# EAGLE schematic VoltCalBoard (EAGLE 6.5.0)
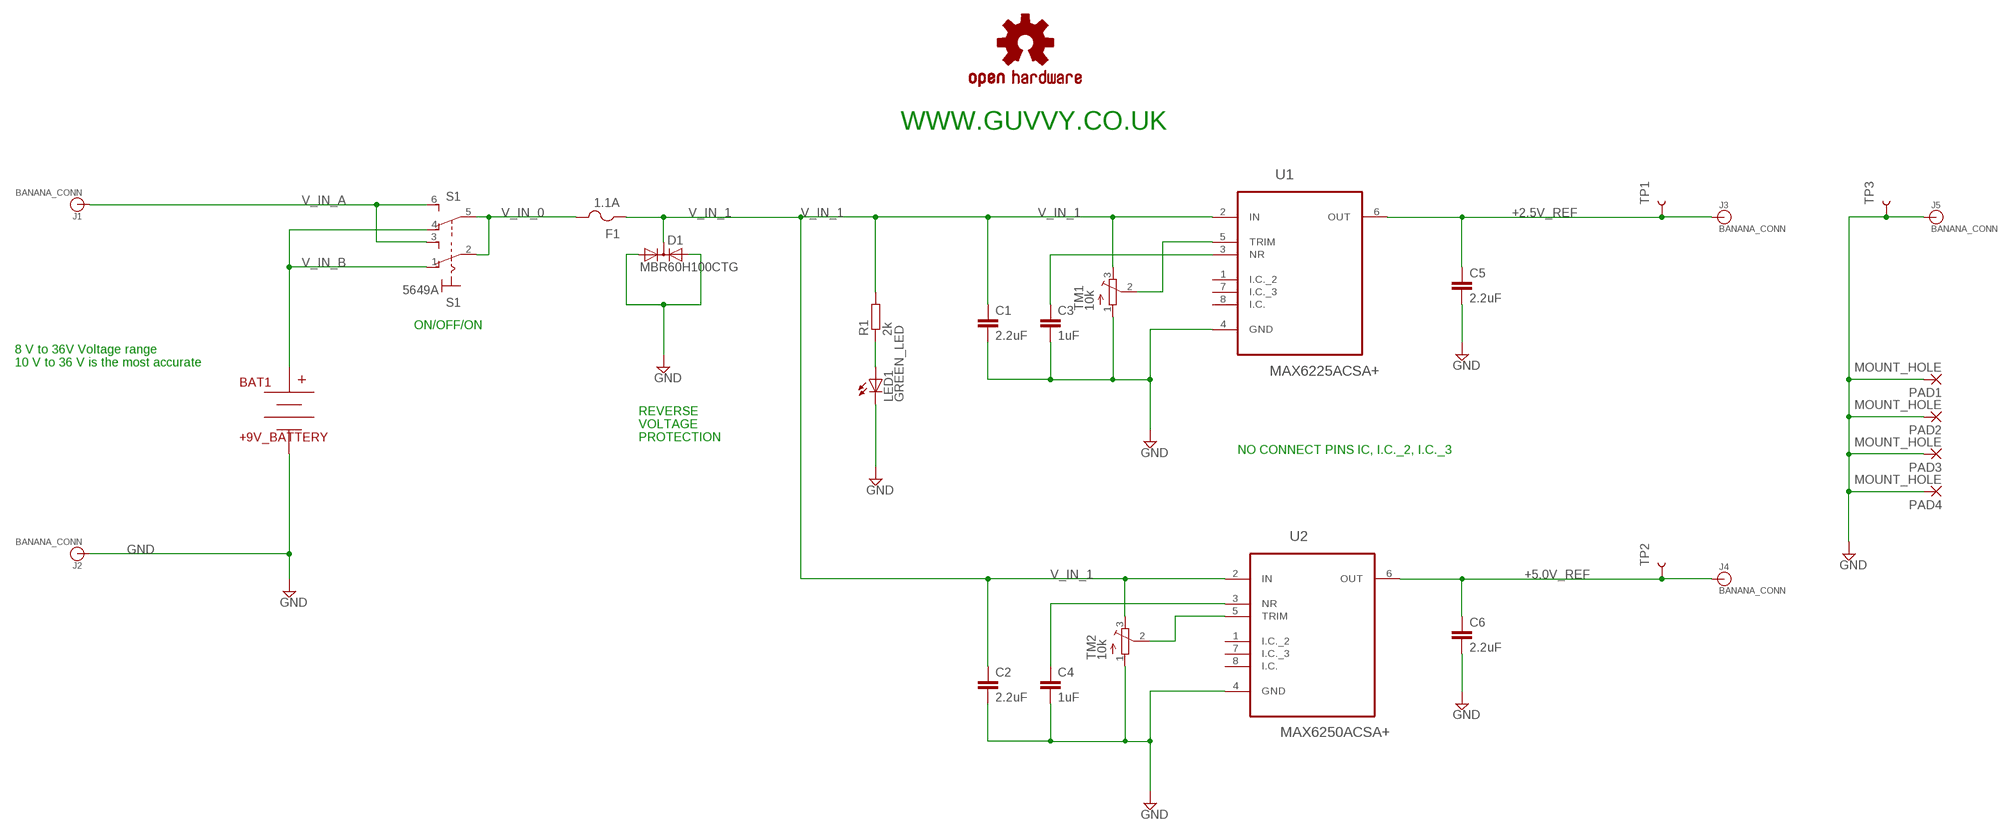
[diagram p0: schematic, sheet 1]

## Parts
BAT1  +9V_BATTERY  BC9VPC  [BC9VPC]
C1  2.2uF  C-EUC0805  [C0805]
C2  2.2uF  C-EUC0805  [C0805]
C3  1uF  C-EUC0805  [C0805]
C4  1uF  C-EUC0805  [C0805]
C5  2.2uF  C-EUC0805  [C0805]
C6  2.2uF  C-EUC0805  [C0805]
D1  MBR60H100CTG  DIODE-2AC|CATO220V  [TO220ABS]
F1  1.1A  PTCFUSE-1812  [1812]
J1  BANANA_CONN  [BANANA_CONN]
J2  BANANA_CONN  [BANANA_CONN]
J3  BANANA_CONN  [BANANA_CONN]
J4  BANANA_CONN  [BANANA_CONN]
J5  BANANA_CONN  [BANANA_CONN]
LED1  GREEN_LED  LEDP-LCC-2  [P-LCC-2]
LOGO1  OSHW-LOGOL  [OSHW-LOGO-L]
PAD1  MOUNT_HOLE  3,81/1,4  [3,81/1,4]
PAD2  MOUNT_HOLE  3,81/1,4  [3,81/1,4]
PAD3  MOUNT_HOLE  3,81/1,4  [3,81/1,4]
PAD4  MOUNT_HOLE  3,81/1,4  [3,81/1,4]
R1  2k  R-EU_R0805  [R0805]
S1  5649A  320-938  [320-938]
TM1  10k  TRIMPOTTC33X  [TC33X]
TM2  10k  TRIMPOTTC33X  [TC33X]
TP1  TP_1MM_TH"  [TP_1MM_TH]
TP2  TP_1MM_TH"  [TP_1MM_TH]
TP3  TP_1MM_TH"  [TP_1MM_TH]
U1  MAX6225ACSA+  [SOIC127P600X175-8N]
U2  MAX6250ACSA+  [SOIC127P600X175-8N]

## Nets
+2.5V_REF: C5.1 J3.P$1 TP1.P$1 U1.6(OUT)
+5.0V_REF: C6.1 J4.P$1 TP2.P$1 U2.6(OUT)
GND: BAT1.V- C1.2 C2.2 C3.2 C4.2 C5.2 C6.2 D1.A1 D1.A2 J2.P$1 J5.P$1 LED1.C PAD1.1(P) PAD2.1(P) PAD3.1(P) PAD4.1(P) TM1.1(A) TM2.1(A) TP3.P$1 U1.4(GND) U2.4(GND)
N$1: TM2.2(S) U2.5(TRIM)
N$3: TM1.2(S) U1.5(TRIM)
N$6: C4.1 U2.3(NR)
N$15: C3.1 U1.3(NR)
N$30: LED1.A R1.1
V_IN_0: F1.2 S1.2(1:P) S1.5(B:P)
V_IN_1: C1.1 C2.1 D1.C F1.1 R1.2 TM1.3(E) TM2.3(E) U1.2(IN) U2.2(IN)
V_IN_A: J1.P$1 S1.3(1:S) S1.6(B:S)
V_IN_B: BAT1.V+ S1.1(1:O) S1.4(B:O)
Unconnected: U1.1(I.C._2) U1.7(I.C._3) U1.8(I.C.) U2.1(I.C._2) U2.7(I.C._3) U2.8(I.C.)

## Notes on the sheet
- WWW.GUVVY.CO.UK
- ON/OFF/ON
- 8 V to 36V Voltage range
  10 V to 36 V is the most accurate
- REVERSE
  VOLTAGE
  PROTECTION
- NO CONNECT PINS IC, I.C._2, I.C._3

## Library data of the parts
BAT1 = BC9VPC_ShortenedSilkScreen:BC9VPC: 9V board-mount battery cradle; OC_FARNELL: unknown; PROD_ID: BATT-10855
C1-C6 = rcl:C-EU: CAPACITOR, European symbol; OC_FARNELL: unknown
D1 = diode:DIODE-2AC|CA: Dual DIODE Anode-Cathode|Cathode-Anode; MF: ON SEMICONDUCTOR; MPN: MBR60H100CTG; OC_FARNELL: 1431072
F1 = adafruit:PTCFUSE: PTC fuses, resettable thermistors; MF: TE CONNECTIVITY / RAYCHEM; MPN: MINISMDC110F/24-2; OC_FARNELL: 1345925
J1-J5 = SparkFun-Connectors:BANANA_CONN: Through-hole banana jack; OC_FARNELL: unknown
LED1 = P-LCC-2_Shorter:LED: LED OSRAM: - CHIPLED LG R971, LG N971, LY N971, LG Q971, LY Q971, LO R971, LY R971 LH N974, LH R974 LS Q976, LO Q976, LY Q976 LO Q996 - Hyper CHIPLED LW Q18S LB Q993, LB Q99A, LB R99A - SideLED LS A670, LO A670, LY A670, LG A670, LP A670 LB A673, LV A673, LT A673, LW A673 LH A674 LY A675 LS A676, LA A676, LO A676, LY A676, LW A676 LS A679, LY A679, LG A679 - Hyper Micro SIDELED® LS Y876, LA Y876, LO Y876, LY Y876 LT Y87S - SmartLED LW L88C, LW L88S LB L89C, LB L89S, LG L890 LS L89K, LO L89K, LY L89K LS L896, LA L896, LO L896, LY L896 - TOPLED LS T670, LO T670, LY T670, LG T670, LP T670 LSG T670, LSP T670, LSY T670, LOP T670, LYG T670 LG T671, LOG T671, LSG T671 LB T673, LV T673, LT T673, LW T673 LH T674 LS T676, LA T676, LO T676, LY T676, LB T676, LH T676, LSB T676, LW T676 LB T67C, LV T67C, LT T67C, LS T67K, LO T67K, LY T67K, LW E67C LS E67B, LA E67B, LO E67B, LY E67B, LB E67C, LV E67C, LT E67C LW T67C LS T679, LY T679, LG T679 LS T770, LO T770, LY T770, LG T770, LP T770 LB T773, LV T773, LT T773, LW T773 LH T774 LS E675, LA E675, LY E675, LS T675 LS T776, LA T776, LO T776, LY T776, LB T776 LHGB T686 LT T68C, LB T68C - Hyper Mini TOPLED® LB M676 - Mini TOPLED Santana® LG M470 LS M47K, LO M47K, LY M47K Source: http://www.osram.convergy.de/; OC_FARNELL: unknown
LOGO1 = SparkFun-Aesthetics:OSHW-LOGO: Open Source Hardware Logo This logo indicates the piece of hardware it is found on incorporates a OSHW license and/or adheres to the definition of open source hardware found here: http://freedomdefined.org/OSHW; OC_FARNELL: unknown
PAD1-PAD4 = wirepad:3,81/1,4: THROUGH-HOLE PAD; OC_FARNELL: unknown
R1 = rcl:R-EU_: RESISTOR, European symbol; OC_FARNELL: unknown
S1 = Switch_320-938_Corrected:320-938: TOGGLE SWITCH distributor RS Components; MF: APEM; MPN: 5649A; OC_FARNELL: 1082316
TM1 TM2 = P-LCC-2_Shorter:TRIMPOT: SMT trimmer potentiometer part number TC33X http://www.ladyada.net/library/eagle; OC_FARNELL: unknown
TP1-TP3 = TP_1MM_TH:TP_1MM_TH: Bare copper test points for troubleshooting or ICT; OC_FARNELL: unknown
U1 = MAX6225ACSA+:MAX6225ACSA+; DESCRIPTION: Low-Noise, Precision, +2.5V/+4.096V/+5V Voltage References; MF: MAXIM INTEGRATED PRODUCTS; MPN: MAX6225ACSA+; OC_FARNELL: 2113189; OC_NEWARK: 59J3522; PACKAGE: SOIC-8; SUPPLIER: Maxim
U2 = MAX62250ACSA+:MAX6250ACSA+: Low-Noise, Precision, +2.5V/+4.096V/+5V Voltage References; MF: MAXIM INTEGRATED PRODUCTS; MPN: MAX6250ACSA+; OC_FARNELL: 1673181; OC_NEWARK: 57K8967; PACKAGE: SOIC-8; SUPPLIER: Maxim